# Altium schematic sheet OpenBLC_MCP73831.SchDoc
size A
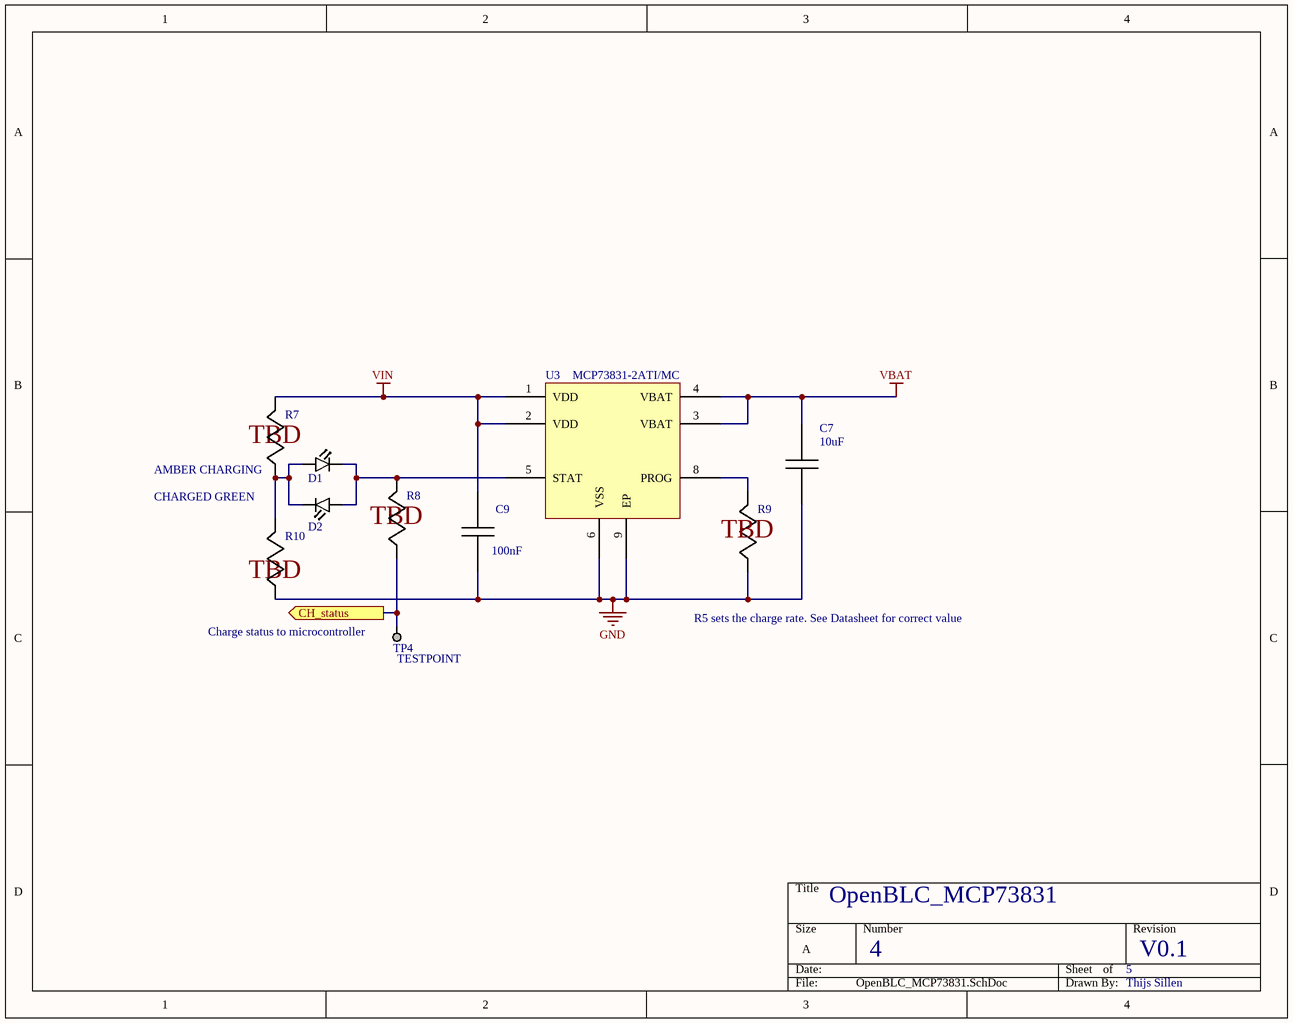
[diagram p0: OpenBLC_MCP73831.SchDoc]

## Parts
C7  Capacitance: 10uF  [0805_CAP]  (hidden comment: GRM21BR61A106KE19L)
C9  =Value: 100nF  [0805_CAP]  (hidden comment: 0805_CAP)
D1  0603LED_YE  [0603 _DIODE_YE]  (value not drawn)
D2  0603LED_GR  [0603 _DIODE_GR]  (value not drawn)
R7  0805_RES  [0805_RES]  (value not drawn)
R8  0805_RES  [0805_RES]  (value not drawn)
R9  0805_RES  [0805_RES]  (value not drawn)
R10  0805_RES  [0805_RES]  (value not drawn)
TP4  TESTPOINT  [Via_TP]
U3  MCP73831-2ATI/MC  [PQFN50P300X200X5_HS-9N]

## Ports
CH_status (out)

## Nets
GND: C7.2 C9.2 R9.2 R10.2 U3.6(VSS) U3.9(EP)
VBAT: C7.1 U3.3(VBAT) U3.4(VBAT)
VIN: C9.1 R7.1 U3.1(VDD) U3.2(VDD)
CH_status: R8.2 TP4.1 ; port CH_status
NetD1_1: D1.1 D2.2 R8.1 U3.5(STAT)
NetD1_2: D1.2 D2.1 R7.2 R10.1
NetR9_1: R9.1 U3.8(PROG)

## Notes on the sheet
- (near R7) AMBER CHARGING
- CHARGED GREEN
- (near R7) TBD
- (near R8) TBD
- (near R9) TBD
- (near TP4) Charge status to microcontroller
- (near R10) TBD
- R5 sets the charge rate. See Datasheet for correct value
- OpenBLC_MCP73831
- 4
- 5
- V0.1
- Thijs Sillen

## Library data of the parts
C7 = GRM21BR61A106KE19L: MURATA - GRM21BR61A106KE19L - CAPACITOR, CERA, 10UF, 10%, 10V, 10%, SMD; Product Range: MURATA - GRM Series; Dielectric Characteristic: X5; Voltage Rating: 10; Ceramic Capacitor Case: 0805 ^2012 Metric]; Supplier 1: Farnell; Supplier Part Number 1: 2396552; Manufacturer: MURATA; RoHS: YES; Stock 1: 20106; Pricing 1: 1=0.042, 250=0.039, 500=0.034, 1000=0.031, 5000=0.022 (EUR); Capacitance Tolerance: ± 10%; MSL: -; ComponentLink1URL: http://www.farnell.com/datasheets/608985.pdf; ComponentLink1Description: http://www.farnell.com/datasheets/608985.pdf; Manufacturer Part Number: GRM21BR61A106KE19L
TP4 = TESTPOINT: TESTPOINT SCOPE GRABBER; Manufacturer Part Number: 5010; Manufacturer: Keystone Electronics; Reel: TH; Supplier 1: Digi-Key; Supplier Part Number 1: 5010K-ND
U3 = MCP73831-2ATI/MC: Batterijbeheer Li-Ion/Li-Poly Charg Mgnt 4.2V Vreg out; Manufacturer: Microchip Technology; Uitgangsstroom: 15 mA to 500 mA; Verpakking / doos: DFN; Verpakken: Tube; Montagetype: SMD/SMT; Batterijtype: Li-Ion, Li-Poly; Fabrikant: Microchip; Maximale bedrijfstemperatuur: + 85 C; Minimale bedrijfstemperatuur: - 40 C; Productcategorie: Battery Management; Standaard pakket hoeveelheid: 150; Supplier 1: Mouser; Supplier Part Number 1: 579-MCP73831-2ATI/MC; RoHS: RoHS Compliant; Category: Batterijbeheer; Stock 1: 0; Pricing 1: 1=0.512, 10=0.472, 25=0.392, 100=0.360 (EUR); Uitgangspanning: 4.2 V; Merk: Microchip Technology; Producttype: Charge Management; RoHS - Mouser: Y; Minimum Order Quantity: 1; Reeling: False; ComponentLink1URL: http://www.mouser.com/ds/2/268/21984e-53484.pdf; ComponentLink1Description: http://www.mouser.com/ds/2/268/21984e-53484.pdf; Manufacturer Part Number: MCP73831-2ATI/MC